# EAGLE design M051X (EAGLE 6.6.0)
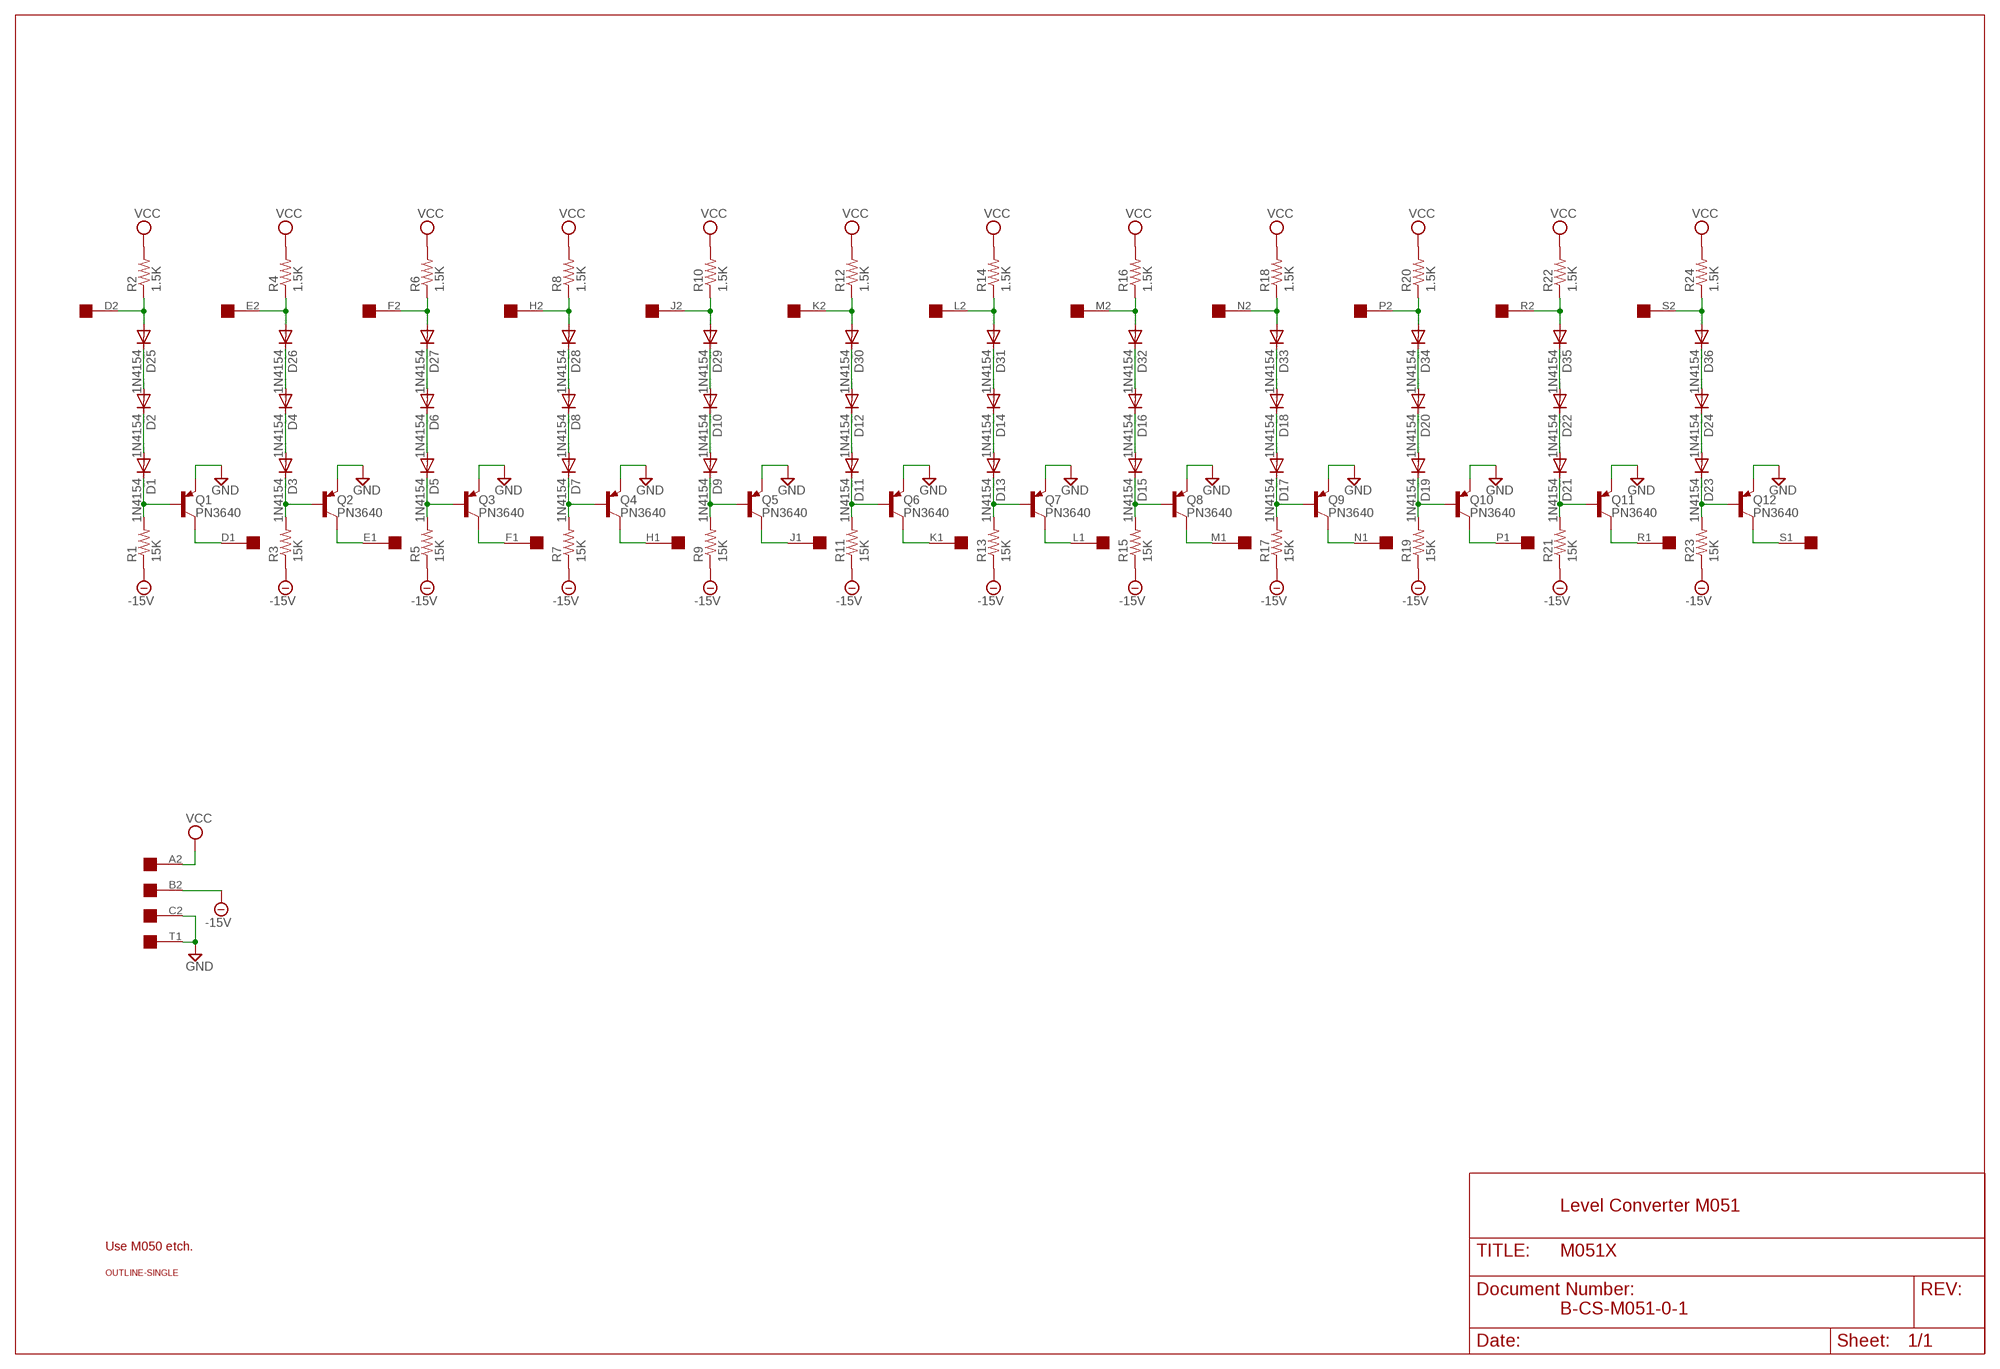
[diagram p0: schematic, sheet 1]

## Parts
D1  1N4154  DIODE-DO35-10  [DO35-10]
D2  1N4154  DIODE-DO35-10  [DO35-10]
D3  1N4154  DIODE-DO35-10  [DO35-10]
D4  1N4154  DIODE-DO35-10  [DO35-10]
D5  1N4154  DIODE-DO35-10  [DO35-10]
D6  1N4154  DIODE-DO35-10  [DO35-10]
D7  1N4154  DIODE-DO35-10  [DO35-10]
D8  1N4154  DIODE-DO35-10  [DO35-10]
D9  1N4154  DIODE-DO35-10  [DO35-10]
D10  1N4154  DIODE-DO35-10  [DO35-10]
D11  1N4154  DIODE-DO35-10  [DO35-10]
D12  1N4154  DIODE-DO35-10  [DO35-10]
D13  1N4154  DIODE-DO35-10  [DO35-10]
D14  1N4154  DIODE-DO35-10  [DO35-10]
D15  1N4154  DIODE-DO35-10  [DO35-10]
D16  1N4154  DIODE-DO35-10  [DO35-10]
D17  1N4154  DIODE-DO35-10  [DO35-10]
D18  1N4154  DIODE-DO35-10  [DO35-10]
D19  1N4154  DIODE-DO35-10  [DO35-10]
D20  1N4154  DIODE-DO35-10  [DO35-10]
D21  1N4154  DIODE-DO35-10  [DO35-10]
D22  1N4154  DIODE-DO35-10  [DO35-10]
D23  1N4154  DIODE-DO35-10  [DO35-10]
D24  1N4154  DIODE-DO35-10  [DO35-10]
D25  1N4154  DIODE-DO35-10  [DO35-10]
D26  1N4154  DIODE-DO35-10  [DO35-10]
D27  1N4154  DIODE-DO35-10  [DO35-10]
D28  1N4154  DIODE-DO35-10  [DO35-10]
D29  1N4154  DIODE-DO35-10  [DO35-10]
D30  1N4154  DIODE-DO35-10  [DO35-10]
D31  1N4154  DIODE-DO35-10  [DO35-10]
D32  1N4154  DIODE-DO35-10  [DO35-10]
D33  1N4154  DIODE-DO35-10  [DO35-10]
D34  1N4154  DIODE-DO35-10  [DO35-10]
D35  1N4154  DIODE-DO35-10  [DO35-10]
D36  1N4154  DIODE-DO35-10  [DO35-10]
Q1  PN3640  -PNP-TO5  [TO5]
Q2  PN3640  -PNP-TO5  [TO5]
Q3  PN3640  -PNP-TO5  [TO5]
Q4  PN3640  -PNP-TO5  [TO5]
Q5  PN3640  -PNP-TO5  [TO5]
Q6  PN3640  -PNP-TO5  [TO5]
Q7  PN3640  -PNP-TO5  [TO5]
Q8  PN3640  -PNP-TO5  [TO5]
Q9  PN3640  -PNP-TO5  [TO5]
Q10  PN3640  -PNP-TO5  [TO5]
Q11  PN3640  -PNP-TO5  [TO5]
Q12  PN3640  -PNP-TO5  [TO5]
R1  15K  R-US_0207/10  [0207/10]
R2  1.5K  R-US_0207/10  [0207/10]
R3  15K  R-US_0207/10  [0207/10]
R4  1.5K  R-US_0207/10  [0207/10]
R5  15K  R-US_0207/10  [0207/10]
R6  1.5K  R-US_0207/10  [0207/10]
R7  15K  R-US_0207/10  [0207/10]
R8  1.5K  R-US_0207/10  [0207/10]
R9  15K  R-US_0207/10  [0207/10]
R10  1.5K  R-US_0207/10  [0207/10]
R11  15K  R-US_0207/10  [0207/10]
R12  1.5K  R-US_0207/10  [0207/10]
R13  15K  R-US_0207/10  [0207/10]
R14  1.5K  R-US_0207/10  [0207/10]
R15  15K  R-US_0207/10  [0207/10]
R16  1.5K  R-US_0207/10  [0207/10]
R17  15K  R-US_0207/10  [0207/10]
R18  1.5K  R-US_0207/10  [0207/10]
R19  15K  R-US_0207/10  [0207/10]
R20  1.5K  R-US_0207/10  [0207/10]
R21  15K  R-US_0207/10  [0207/10]
R22  1.5K  R-US_0207/10  [0207/10]
R23  15K  R-US_0207/10  [0207/10]
R24  1.5K  R-US_0207/10  [0207/10]
U$1  OUTLINE-SINGLE  [SINGLE]
U$2  SINGLE  [EDGE-CON2]

## Nets
-15V [supply]: R1.1 R3.1 R5.1 R7.1 R9.1 R11.1 R13.1 R15.1 R17.1 R19.1 R21.1 R23.1 U$2.B2
D7: D6.A D27.C
GND [supply]: Q1.1(E) Q2.1(E) Q3.1(E) Q4.1(E) Q5.1(E) Q6.1(E) Q7.1(E) Q8.1(E) Q9.1(E) Q10.1(E) Q11.1(E) Q12.1(E) U$2.C2 U$2.T1
N$1: D25.A R2.1 U$2.D2
N$2: D2.A D25.C
N$3: D1.A D2.C
N$4: D1.C Q1.2(B) R1.2
N$5: Q1.3(C) U$2.D1
N$6: D26.A R4.1 U$2.E2
N$7: D4.A D26.C
N$8: D3.A D4.C
N$9: D3.C Q2.2(B) R3.2
N$10: Q2.3(C) U$2.E1
N$11: D27.A R6.1 U$2.F2
N$13: D5.A D6.C
N$14: D5.C Q3.2(B) R5.2
N$15: Q3.3(C) U$2.F1
N$16: D28.A R8.1 U$2.H2
N$17: D8.A D28.C
N$18: D7.A D8.C
N$19: D7.C Q4.2(B) R7.2
N$20: Q4.3(C) U$2.H1
N$21: D29.A R10.1 U$2.J2
N$22: D10.A D29.C
N$23: D9.A D10.C
N$24: D9.C Q5.2(B) R9.2
N$25: Q5.3(C) U$2.J1
N$26: D30.A R12.1 U$2.K2
N$27: D12.A D30.C
N$28: D11.A D12.C
N$29: D11.C Q6.2(B) R11.2
N$30: Q6.3(C) U$2.K1
N$31: D31.A R14.1 U$2.L2
N$32: D14.A D31.C
N$33: D13.A D14.C
N$34: D13.C Q7.2(B) R13.2
N$35: Q7.3(C) U$2.L1
N$36: D32.A R16.1 U$2.M2
N$37: D16.A D32.C
N$38: D15.A D16.C
N$39: D15.C Q8.2(B) R15.2
N$40: Q8.3(C) U$2.M1
N$41: D33.A R18.1 U$2.N2
N$42: D18.A D33.C
N$43: D17.A D18.C
N$44: D17.C Q9.2(B) R17.2
N$45: Q9.3(C) U$2.N1
N$46: D34.A R20.1 U$2.P2
N$47: D20.A D34.C
N$48: D19.A D20.C
N$49: D19.C Q10.2(B) R19.2
N$50: Q10.3(C) U$2.P1
N$51: D35.A R22.1 U$2.R2
N$52: D22.A D35.C
N$53: D21.A D22.C
N$54: D21.C Q11.2(B) R21.2
N$55: Q11.3(C) U$2.R1
N$56: D36.A R24.1 U$2.S2
N$57: D24.A D36.C
N$58: D23.A D24.C
N$59: D23.C Q12.2(B) R23.2
N$60: Q12.3(C) U$2.S1
VCC [supply]: R2.2 R4.2 R6.2 R8.2 R10.2 R12.2 R14.2 R16.2 R18.2 R20.2 R22.2 R24.2 U$2.A2
Unconnected: U$2.A1 U$2.B1 U$2.C1 U$2.T2 U$2.U1 U$2.U2 U$2.V1 U$2.V2

## Notes on the sheet
- Level Converter M051
- Use M050 etch.
- B-CS-M051-0-1

## Library data of the parts
D1-D36 = diode:DIODE-: DIODE
Q1-Q12 = transistor:*-PNP-: PNP Transistror
R1-R24 = rcl:R-US_: RESISTOR, American symbol
U$1 = dec-con:OUTLINE-*: Board outlines for DEC boards.
U$2 = dec-con:SINGLE: Single-Height DEC board

## Net classes
1 supply: width 0.813 mm

## Board
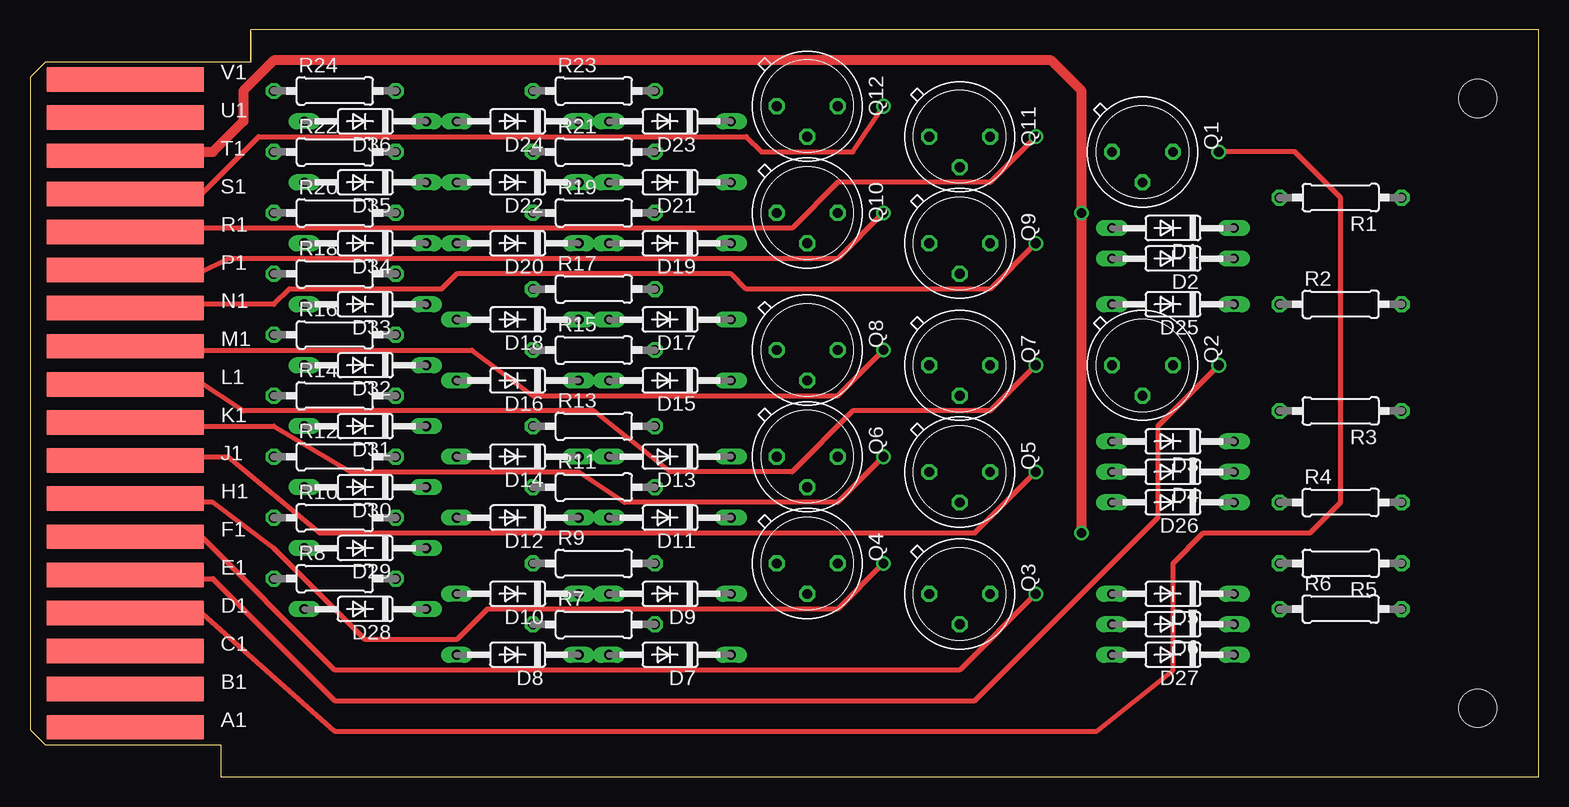
[diagram p1: board, top side]
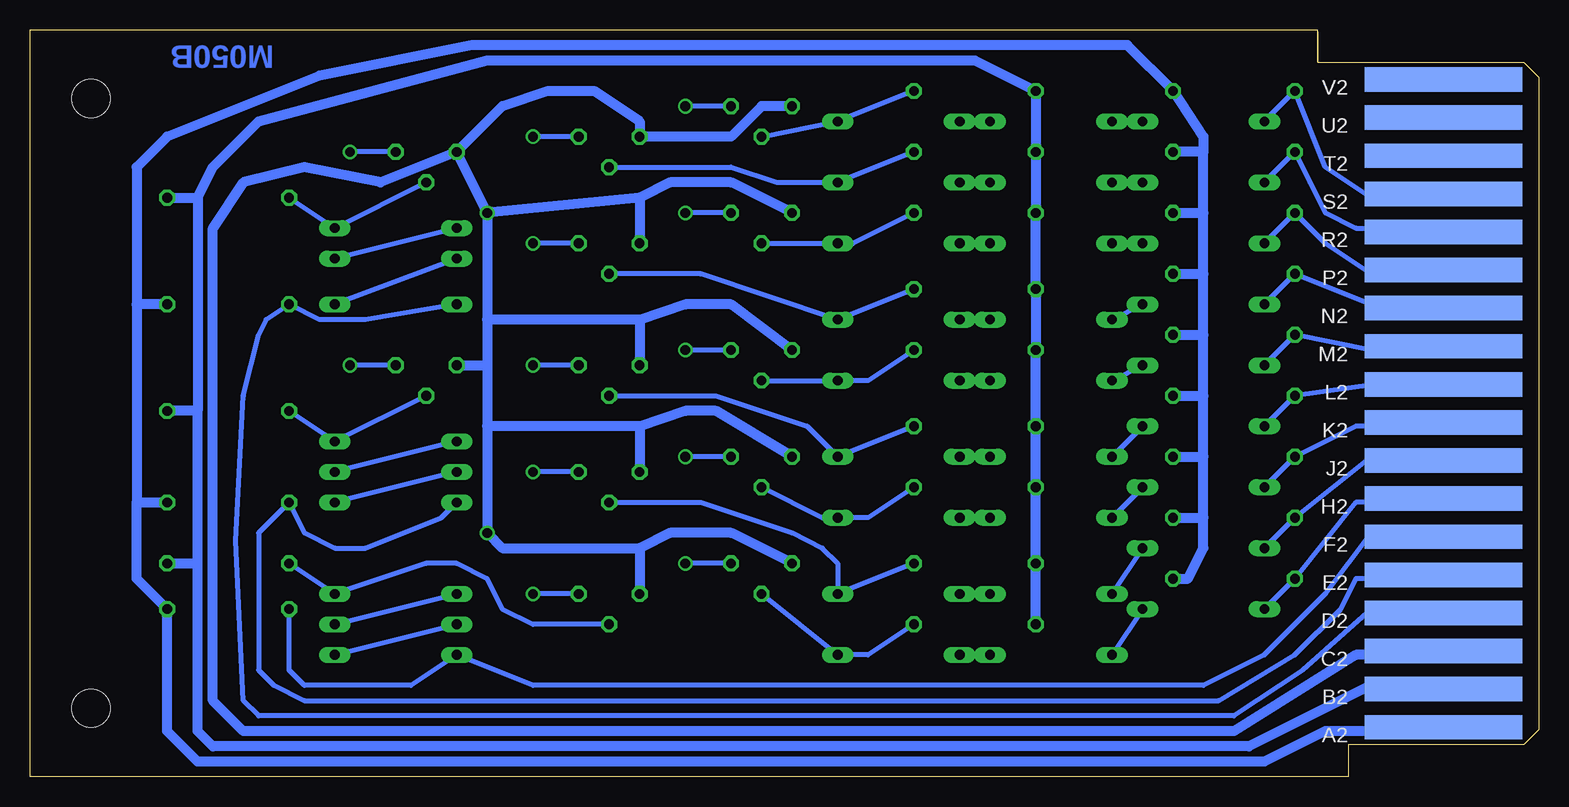
[diagram p2: board, bottom side, seen from below]

Size 125.73 x 62.23 mm. Coordinates in mm from the lower left corner, seen from the top.
Copper layers (1+16): Top 0.035mm / dielectric 1.5mm / Bottom 0.035mm
Design rules "16mils": minimum track width 16mil, minimum drill 32mil, track to track 15mil, track to pad 10mil, pad to pad 10mil, via to via 10mil, smd to smd 10mil, copper to edge 13mil, drill to drill 10mil, minimum pad ring 10mil, minimum via ring 8mil, stop-mask expansion 0mil, vias tented up to drill 0mil, thermal gap 10mil

### Footprints (pad centres in the part's own frame; a part is rotated, then mirrored left to right if it is on the bottom)
DO35-10 = drill 0.813 long: A 5.08,0; C -5.08,0
TO5 = drill 0.813 octagon: 1 0,-2.54; 2 2.54,0; 3 0,2.54
0207/10 = drill 0.813 octagon: 1 -5.08,0; 2 5.08,0
SINGLE = hole 3.175: 120.65,56.515; 120.65,5.715
EDGE-CON2 = smd 13.106 x 2.032: A1 7.938,4.128; B1 7.938,7.303; C1 7.938,10.477; D1 7.938,13.652; E1 7.938,16.828; F1 7.938,20.003; H1 7.938,23.177; J1 7.938,26.352; K1 7.938,29.527; L1 7.938,32.703; M1 7.938,35.877; N1 7.938,39.053; P1 7.938,42.227; R1 7.938,45.403; S1 7.938,48.578; T1 7.938,51.752; U1 7.938,54.928; V1 7.938,58.102 | smd 13.106 x 2.032 bottom: A2 7.938,4.128; B2 7.938,7.303; C2 7.938,10.477; D2 7.938,13.652; E2 7.938,16.828; F2 7.938,20.003; H2 7.938,23.177; J2 7.938,26.352; K2 7.938,29.527; L2 7.938,32.703; M2 7.938,35.877; N2 7.938,39.053; P2 7.938,42.227; R2 7.938,45.403; S2 7.938,48.578; T2 7.938,51.752; U2 7.938,54.928; V2 7.938,58.102

### Placement (x,y rotation side)
D1  95.25,45.72 180 top
D2  95.25,43.18 180 top
D3  95.25,27.94 180 top
D4  95.25,25.4 180 top
D5  95.25,15.24 180 top
D6  95.25,12.7 180 top
D7  53.34,10.16 180 top
D8  40.64,10.16 180 top
D9  53.34,15.24 180 top
D10  40.64,15.24 180 top
D11  53.34,21.59 180 top
D12  40.64,21.59 180 top
D13  53.34,26.67 180 top
D14  40.64,26.67 180 top
D15  53.34,33.02 180 top
D16  40.64,33.02 180 top
D17  53.34,38.1 180 top
D18  40.64,38.1 180 top
D19  53.34,44.45 180 top
D20  40.64,44.45 180 top
D21  53.34,49.53 180 top
D22  40.64,49.53 180 top
D23  53.34,54.61 180 top
D24  40.64,54.61 180 top
D25  95.25,39.37 180 top
D26  95.25,22.86 180 top
D27  95.25,10.16 180 top
D28  27.94,13.97 180 top
D29  27.94,19.05 180 top
D30  27.94,24.13 180 top
D31  27.94,29.21 180 top
D32  27.94,34.29 180 top
D33  27.94,39.37 180 top
D34  27.94,44.45 180 top
D35  27.94,49.53 180 top
D36  27.94,54.61 180 top
Q1  92.71,52.07 270 top
Q2  92.71,34.29 270 top
Q3  77.47,15.24 270 top
Q4  64.77,17.78 270 top
Q5  77.47,25.4 270 top
Q6  64.77,26.67 270 top
Q7  77.47,34.29 270 top
Q8  64.77,35.56 270 top
Q9  77.47,44.45 270 top
Q10  64.77,46.99 270 top
Q11  77.47,53.34 270 top
Q12  64.77,55.88 270 top
R1  109.22,48.26 180 top
R2  109.22,39.37 0 top
R3  109.22,30.48 180 top
R4  109.22,22.86 0 top
R5  109.22,17.78 180 top
R6  109.22,13.97 0 top
R7  46.99,12.7 0 top
R8  25.4,16.51 0 top
R9  46.99,17.78 0 top
R10  25.4,21.59 0 top
R11  46.99,24.13 0 top
R12  25.4,26.67 0 top
R13  46.99,29.21 0 top
R14  25.4,31.75 0 top
R15  46.99,35.56 0 top
R16  25.4,36.83 0 top
R17  46.99,40.64 0 top
R18  25.4,41.91 0 top
R19  46.99,46.99 0 top
R20  25.4,46.99 0 top
R21  46.99,52.07 0 top
R22  25.4,52.07 0 top
R23  46.99,57.15 0 top
R24  25.4,57.15 0 top
U$1  0,0 0 top
U$2  0,0 0 top

### Tracks (layer width: path | path; a pad name or v marks a point on that pad's centre or on a via)
-15V
  Bottom 0.813: R1.1 111.76,48.26 | 111.76,48.26 111.76,30.48 | 111.76,30.48 R3.1 | R5.1 111.76,17.78 | 111.76,17.78 111.76,30.48 | U$2.B2 8.89,7.62 13.97,7.62 24.13,2.54 110.49,2.54 111.76,3.81 111.76,17.78 | R7.1 R9.1 R11.1 R13.1 R15.1 R17.1 R19.1 R21.1 R23.1 46.99,59.69 87.63,59.69 106.68,54.61 110.49,50.8 111.76,48.26
D7
  Bottom 0.406: D27.C D6.A
GND  (via drill 0.81)
  Top 0.813: v87.63,20.32 v87.63,46.99 87.63,57.15 85.09,59.69 20.32,59.69 17.78,57.15 17.78,54.61 15.24,52.07 8.89,52.07 U$2.T1
  Bottom 0.813: U$2.C2 8.89,10.16 15.24,10.16 25.4,3.81 107.95,3.81 110.49,6.35 110.49,45.72 107.95,49.53 102.87,50.8 96.52,49.53 Q1.1 | Q4.1 67.31,20.32 72.39,20.32 74.93,19.05 | 74.93,19.05 Q3.1 | Q6.1 68.58,30.48 71.12,30.48 74.93,29.21 | 74.93,29.21 Q5.1 | Q8.1 67.31,39.37 71.12,39.37 74.93,38.1 | 74.93,38.1 Q7.1 | Q12.1 64.77,55.88 67.31,53.34 Q11.1 74.93,54.61 78.74,57.15 82.55,57.15 86.36,55.88 Q1.1 | Q10.1 67.31,49.53 72.39,49.53 74.93,48.26 | 74.93,48.26 Q9.1 | 74.93,48.26 v87.63,46.99 | v87.63,46.99 Q1.1 | v87.63,46.99 87.63,38.1 | 87.63,38.1 87.63,34.29 | 87.63,34.29 87.63,29.21 | 87.63,29.21 v87.63,20.32 86.36,19.05 74.93,19.05 | 74.93,29.21 87.63,29.21 | 74.93,38.1 87.63,38.1 | Q2.1 87.63,34.29
N$1
  Bottom 0.406: U$2.D2 14.29,13.65 19.69,8.89 25.4,5.08 106.68,5.08 107.95,6.35 108.59,19.68 107.95,31.75 106.68,36.83 106.05,38.1 R2.1 101.6,38.1 97.79,38.1 D25.A
N$2
  Bottom 0.406: D2.A D25.C
N$3
  Bottom 0.406: D1.A D2.C
N$4
  Bottom 0.406: Q1.2 D1.C R1.2
N$5  (via drill 0.81)
  Top 0.406: U$2.D1 8.89,13.97 13.97,13.97 25.4,3.81 88.9,3.81 95.25,8.89 95.25,17.78 97.79,20.32 106.68,20.32 109.22,22.86 109.22,48.26 105.41,52.07 v99.06,52.07
  Bottom 0.406: Q1.3 v99.06,52.07
N$6
  Bottom 0.406: D26.A 91.44,21.59 97.79,19.05 100.33,19.05 102.87,20.32 R4.1 106.68,20.32 106.68,8.89 105.41,7.62 102.87,6.35 26.67,6.35 20.32,10.16 16.51,13.97 15.24,16.51 10.16,16.51 U$2.E2
N$7
  Bottom 0.406: D4.A D26.C
N$8
  Bottom 0.406: D3.A D4.C
N$9
  Bottom 0.406: Q2.2 D3.C R3.2
N$10  (via drill 0.81)
  Top 0.406: U$2.E1 8.89,16.51 15.24,16.51 25.4,6.35 78.74,6.35 93.98,21.59 93.98,29.21 v99.06,34.29
  Bottom 0.406: Q2.3 v99.06,34.29
N$11
  Bottom 0.406: U$2.F2 8.89,20.32 13.97,20.32 17.78,15.24 22.86,10.16 27.94,7.62 83.82,7.62 D27.A 93.98,7.62 102.87,7.62 104.14,8.89 R6.1
N$13
  Bottom 0.406: D6.C D5.A
N$14
  Bottom 0.406: R5.2 D5.C 92.71,17.78 90.17,17.78 87.63,16.51 86.36,13.97 83.82,12.7 Q3.2
N$15  (via drill 0.81)
  Top 0.406: v83.82,15.24 77.47,8.89 25.4,8.89 13.97,20.32 8.89,20.32 U$2.F1
  Bottom 0.406: Q3.3 v83.82,15.24
N$16
  Bottom 0.406: U$2.H2 8.89,22.86 15.24,22.86 R8.1 D28.A
N$17
  Bottom 0.406: D28.C D8.A
N$18
  Bottom 0.406: D8.C D7.A
N$19
  Bottom 0.406: R7.2 55.88,10.16 D7.C Q4.2
N$20  (via drill 0.81)
  Top 0.406: v71.12,17.78 67.31,13.97 38.1,13.97 35.56,11.43 27.94,11.43 20.32,19.05 15.24,22.86 8.89,22.86 U$2.H1
  Bottom 0.406: Q4.3 v71.12,17.78
N$21
  Bottom 0.406: D29.A R10.1 13.97,26.67 10.16,26.67 U$2.J2
N$22
  Bottom 0.406: D10.A D29.C
N$23
  Bottom 0.406: D10.C D9.A
N$24
  Bottom 0.406: R9.2 D9.C 58.42,17.78 59.69,19.05 62.23,20.32 69.85,22.86 Q5.2
N$25  (via drill 0.81)
  Top 0.406: v83.82,25.4 78.74,20.32 24.13,20.32 16.51,26.67 10.16,26.67 U$2.J1
  Bottom 0.406: Q5.3 v83.82,25.4
N$26
  Bottom 0.406: D30.A R12.1 15.24,29.21 10.16,29.21 U$2.K2
N$27
  Bottom 0.406: D30.C D12.A
N$28
  Bottom 0.406: D12.C D11.A
N$29
  Bottom 0.406: R11.2 55.88,21.59 D11.C 59.69,21.59 Q6.2
N$30  (via drill 0.81)
  Top 0.406: v71.12,26.67 67.31,22.86 49.53,22.86 45.72,25.4 26.67,25.4 20.32,29.21 10.16,29.21 U$2.K1
  Bottom 0.406: Q6.3 v71.12,26.67
N$31
  Bottom 0.406: D31.A R14.1 11.43,33.02 U$2.L2
N$32
  Bottom 0.406: D31.C D14.A
N$33
  Bottom 0.406: D14.C D13.A
N$34
  Bottom 0.406: R13.2 D13.C 60.96,29.21 68.58,31.75 Q7.2
N$35  (via drill 0.81)
  Top 0.406: v83.82,34.29 80.01,30.48 68.58,30.48 63.5,25.4 53.34,25.4 46.99,30.48 17.78,30.48 13.97,33.02 U$2.L1
  Bottom 0.406: Q7.3 v83.82,34.29
N$36
  Bottom 0.406: D32.A R16.1 13.97,35.56 8.89,35.56 U$2.M2
N$37
  Bottom 0.406: D32.C D16.A
N$38
  Bottom 0.406: D16.C D15.A
N$39
  Bottom 0.406: R15.2 55.88,33.02 D15.C Q8.2
N$40  (via drill 0.81)
  Top 0.406: v71.12,35.56 67.31,31.75 41.91,31.75 36.83,35.56 8.89,35.56 U$2.M1
  Bottom 0.406: Q8.3 v71.12,35.56
N$41
  Bottom 0.406: D33.A R18.1 13.97,39.37 8.89,39.37 U$2.N2
N$42
  Bottom 0.406: D33.C D18.A
N$43
  Bottom 0.406: D18.C D17.A
N$44
  Bottom 0.406: R17.2 D17.C 69.85,41.91 Q9.2
N$45  (via drill 0.81)
  Top 0.406: v83.82,44.45 80.01,40.64 59.69,40.64 58.42,41.91 35.56,41.91 34.29,40.64 21.59,40.64 20.32,39.37 8.89,39.37 U$2.N1
  Bottom 0.406: Q9.3 v83.82,44.45
N$46
  Bottom 0.406: D34.A R20.1 17.78,44.45 13.97,41.91 8.89,41.91 U$2.P2
N$47
  Bottom 0.406: D34.C D20.A
N$48
  Bottom 0.406: D20.C D19.A
N$49
  Bottom 0.406: R19.2 57.15,44.45 D19.C Q10.2
N$50  (via drill 0.81)
  Top 0.406: v71.12,46.99 67.31,43.18 16.51,43.18 13.97,41.91 8.89,41.91 U$2.P1
  Bottom 0.406: Q10.3 v71.12,46.99
N$51
  Bottom 0.406: D35.A R22.1 19.05,49.53 17.78,46.99 15.24,45.72 8.89,45.72 U$2.R2
N$52
  Bottom 0.406: D35.C D22.A
N$53
  Bottom 0.406: D21.A D22.C
N$54
  Bottom 0.406: R21.2 D21.C 63.5,49.53 67.31,50.8 Q11.2
N$55  (via drill 0.81)
  Top 0.406: v83.82,53.34 80.01,49.53 67.31,49.53 63.5,45.72 8.89,45.72 U$2.R1
  Bottom 0.406: Q11.3 v83.82,53.34
N$56
  Bottom 0.406: U$2.S2 11.43,48.26 13.97,48.26 17.78,50.8 R24.1 D36.A
N$57
  Bottom 0.406: D36.C D24.A
N$58
  Bottom 0.406: D24.C D23.A
N$59
  Bottom 0.406: R23.2 D23.C Q12.2
N$60  (via drill 0.81)
  Top 0.406: U$2.S1 10.16,48.26 13.97,48.26 19.05,53.34 59.69,53.34 60.96,52.07 68.58,52.07 v71.12,55.88
  Bottom 0.406: Q12.3 v71.12,55.88
VCC
  Bottom 0.813: 116.84,39.37 116.84,50.8 114.3,53.34 101.6,58.42 88.9,60.96 34.29,60.96 R24.2 27.94,53.34 27.94,52.07 | 116.84,22.86 116.84,16.51 R6.2 114.3,3.81 111.76,1.27 22.86,1.27 17.78,3.81 8.89,3.81 U$2.A2 | 116.84,22.86 R4.2 | R2.2 116.84,39.37 | 116.84,39.37 116.84,22.86 | 27.94,52.07 R22.2 | R20.2 27.94,46.99 | 27.94,46.99 27.94,52.07 | R8.2 29.21,16.51 27.94,19.05 27.94,21.59 | 27.94,21.59 27.94,26.67 | 27.94,26.67 27.94,31.75 | 27.94,31.75 27.94,36.83 | 27.94,36.83 27.94,41.91 | 27.94,41.91 27.94,46.99 | R18.2 27.94,41.91 | R16.2 27.94,36.83 | R14.2 27.94,31.75 | R12.2 27.94,26.67 | R10.2 27.94,21.59

### Text on the board
Bottom: M050B